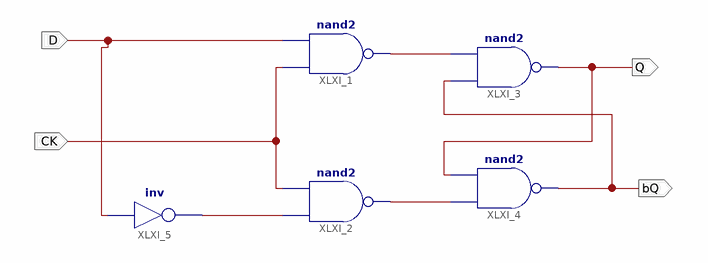
[diagram p0: schematic sheet 1]
// Xilinx ISE schematic D_FF_C.sch (spartan6) as structural Verilog: 5 symbols, 4 ports
module D_FF_C (
  input  D,
  input  CK,
  output bQ,
  output Q
);

  wire XLXN_6, XLXN_9, XLXN_10;

  nand XLXI_1 (XLXN_9, CK, D);
  nand XLXI_2 (XLXN_10, XLXN_6, CK);
  nand XLXI_3 (Q, bQ, XLXN_9);
  nand XLXI_4 (bQ, XLXN_10, Q);
  not XLXI_5 (XLXN_6, D);
endmodule
